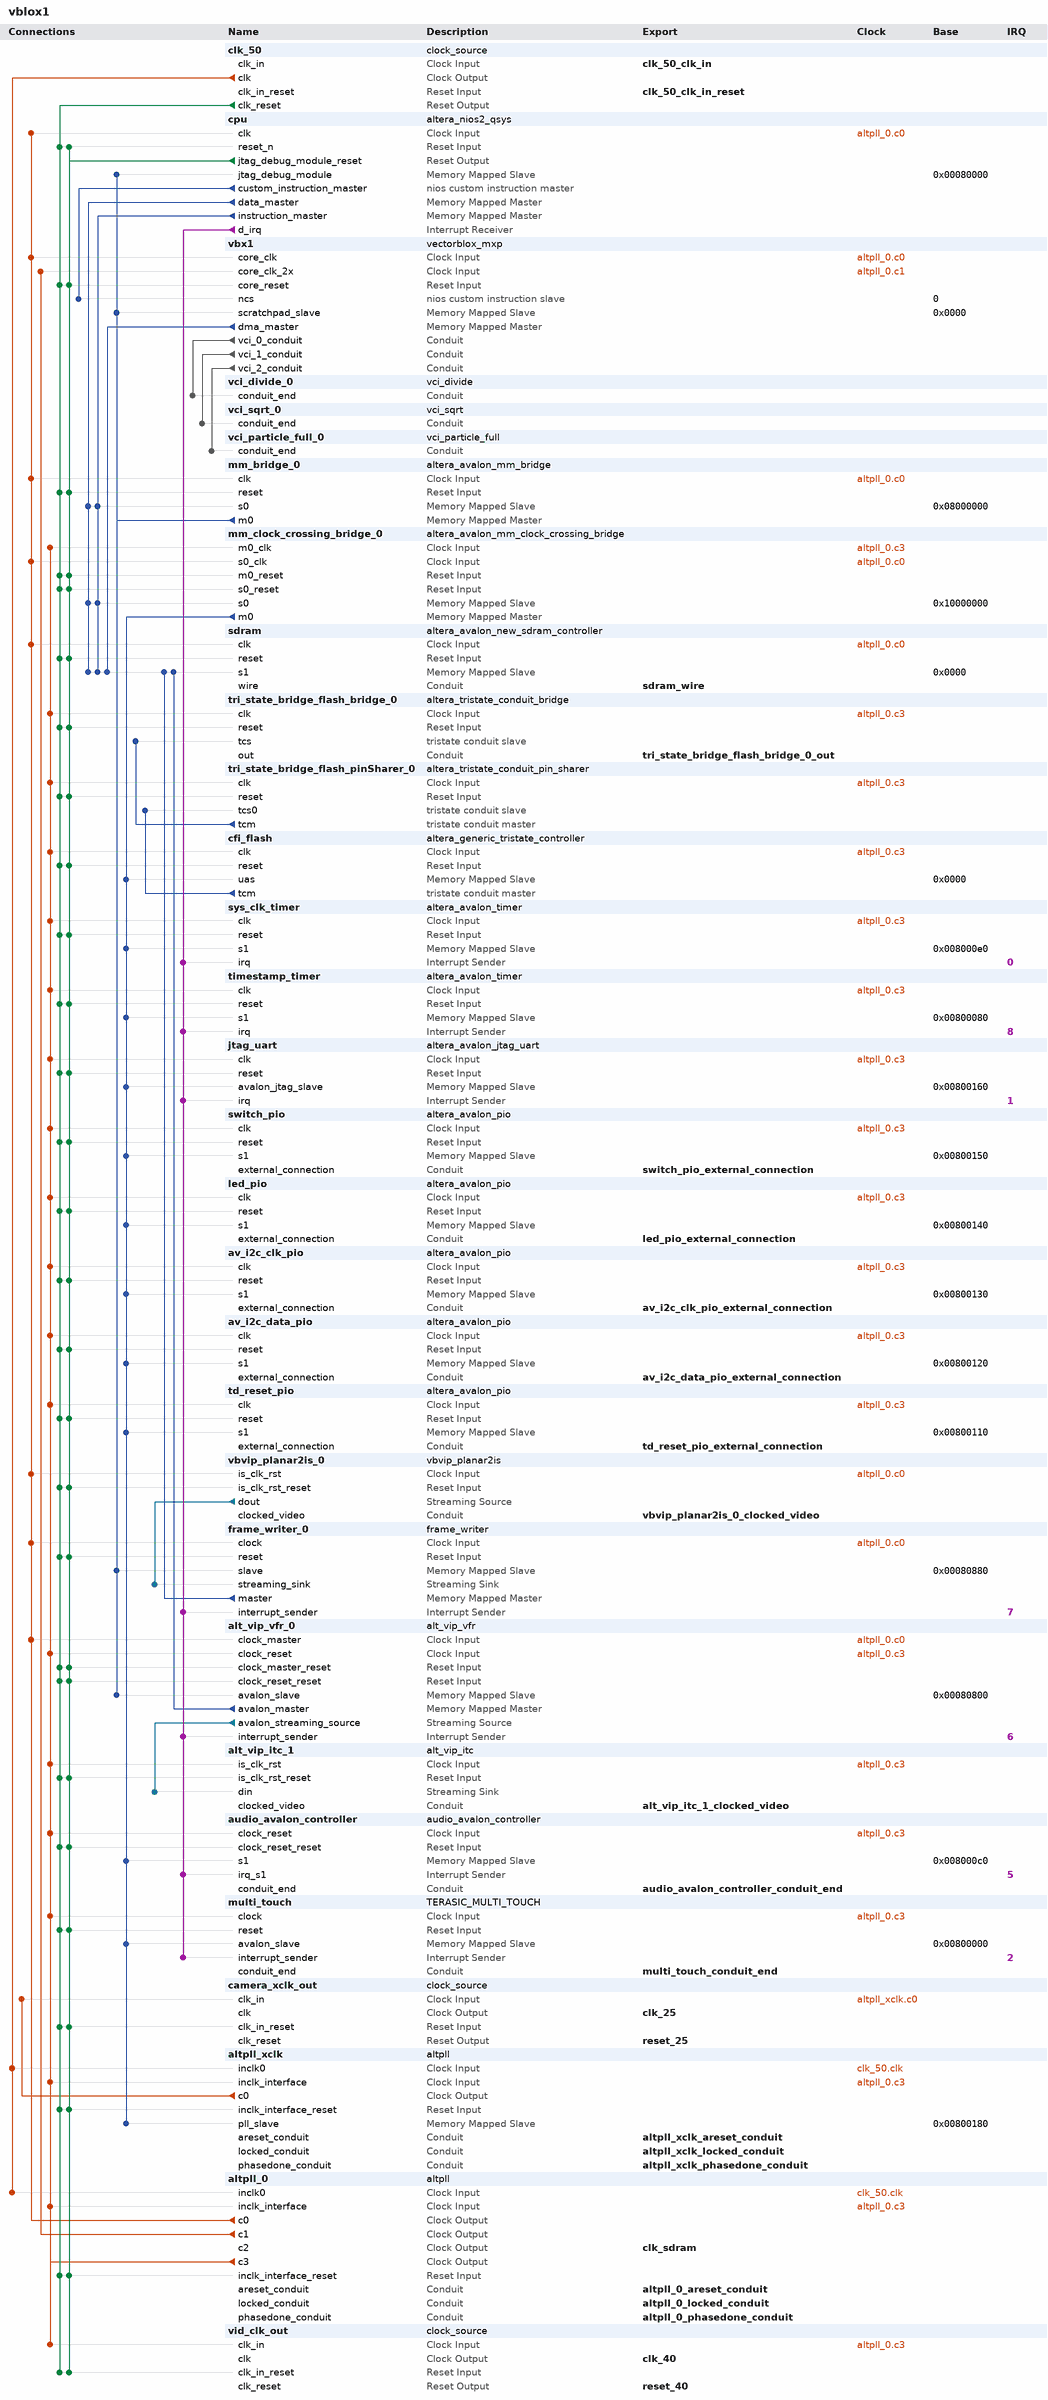
[diagram p0: system contents]
# Platform Designer (Qsys) system vblox1, Cyclone IV E EP4CE115F29C7
# Parameters at their usual value, and those the tool derives, are not listed.
package require -exact qsys 13.1
create_system vblox1
set_project_property DEVICE_FAMILY {Cyclone IV E}
set_project_property DEVICE EP4CE115F29C7

add_instance clk_50 clock_source 13.1
set_instance_parameter_value clk_50 clockFrequency 50000000

add_instance cpu altera_nios2_qsys 13.1
set_instance_parameter_value cpu manuallyAssignCpuID false
set_instance_parameter_value cpu resetSlave cfi_flash.uas
set_instance_parameter_value cpu exceptionSlave sdram.s1
set_instance_parameter_value cpu breakSlave cpu.jtag_debug_module
set_instance_parameter_value cpu impl Fast
set_instance_parameter_value cpu icache_size 8192
set_instance_parameter_value cpu icache_burstType Sequential
set_instance_parameter_value cpu dcache_bursts true
set_instance_parameter_value cpu dcache_size 4096

add_instance vbx1 vectorblox_mxp 1.0
set_instance_parameter_value vbx1 VECTOR_LANES 2
set_instance_parameter_value vbx1 MEMORY_WIDTH_LANES 1
set_instance_parameter_value vbx1 BEATS_PER_BURST 8
set_instance_parameter_value vbx1 SCRATCHPAD_KB 128
set_instance_parameter_value vbx1 MIN_MULTIPLIER_HW BYTE
set_instance_parameter_value vbx1 MASK_PARTITIONS 1
set_instance_parameter_value vbx1 MAX_MASKED_WAVES 256
set_instance_parameter_value vbx1 VECTOR_CUSTOM_INSTRUCTIONS 3
set_instance_parameter_value vbx1 VCI_0_LANES 2
set_instance_parameter_value vbx1 VCI_0_OPCODE_START 0
set_instance_parameter_value vbx1 VCI_0_FUNCTIONS 1
set_instance_parameter_value vbx1 VCI_0_FUNCTION_0_DEPTH 50
set_instance_parameter_value vbx1 VCI_0_FUNCTION_1_DEPTH 0
set_instance_parameter_value vbx1 VCI_0_FUNCTION_2_DEPTH 0
set_instance_parameter_value vbx1 VCI_0_FUNCTION_3_DEPTH 0
set_instance_parameter_value vbx1 VCI_0_FUNCTION_4_DEPTH 0
set_instance_parameter_value vbx1 VCI_0_FUNCTION_5_DEPTH 0
set_instance_parameter_value vbx1 VCI_0_FUNCTION_6_DEPTH 0
set_instance_parameter_value vbx1 VCI_0_FUNCTION_7_DEPTH 0
set_instance_parameter_value vbx1 VCI_0_FUNCTION_8_DEPTH 0
set_instance_parameter_value vbx1 VCI_0_FUNCTION_9_DEPTH 0
set_instance_parameter_value vbx1 VCI_0_FUNCTION_10_DEPTH 0
set_instance_parameter_value vbx1 VCI_0_FUNCTION_11_DEPTH 0
set_instance_parameter_value vbx1 VCI_0_FUNCTION_12_DEPTH 0
set_instance_parameter_value vbx1 VCI_0_FUNCTION_13_DEPTH 0
set_instance_parameter_value vbx1 VCI_0_FUNCTION_14_DEPTH 0
set_instance_parameter_value vbx1 VCI_0_FUNCTION_15_DEPTH 0
set_instance_parameter_value vbx1 VCI_0_MODIFIES_DEST_ADDR false
set_instance_parameter_value vbx1 VCI_1_LANES 2
set_instance_parameter_value vbx1 VCI_1_OPCODE_START 1
set_instance_parameter_value vbx1 VCI_1_FUNCTIONS 1
set_instance_parameter_value vbx1 VCI_1_FUNCTION_0_DEPTH 16
set_instance_parameter_value vbx1 VCI_1_FUNCTION_1_DEPTH 0
set_instance_parameter_value vbx1 VCI_1_FUNCTION_2_DEPTH 0
set_instance_parameter_value vbx1 VCI_1_FUNCTION_3_DEPTH 0
set_instance_parameter_value vbx1 VCI_1_FUNCTION_4_DEPTH 0
set_instance_parameter_value vbx1 VCI_1_FUNCTION_5_DEPTH 0
set_instance_parameter_value vbx1 VCI_1_FUNCTION_6_DEPTH 0
set_instance_parameter_value vbx1 VCI_1_FUNCTION_7_DEPTH 0
set_instance_parameter_value vbx1 VCI_1_FUNCTION_8_DEPTH 0
set_instance_parameter_value vbx1 VCI_1_FUNCTION_9_DEPTH 0
set_instance_parameter_value vbx1 VCI_1_FUNCTION_10_DEPTH 0
set_instance_parameter_value vbx1 VCI_1_FUNCTION_11_DEPTH 0
set_instance_parameter_value vbx1 VCI_1_FUNCTION_12_DEPTH 0
set_instance_parameter_value vbx1 VCI_1_FUNCTION_13_DEPTH 0
set_instance_parameter_value vbx1 VCI_1_FUNCTION_14_DEPTH 0
set_instance_parameter_value vbx1 VCI_1_MODIFIES_DEST_ADDR false
set_instance_parameter_value vbx1 VCI_2_LANES 2
set_instance_parameter_value vbx1 VCI_2_OPCODE_START 3
set_instance_parameter_value vbx1 VCI_2_FUNCTIONS 1
set_instance_parameter_value vbx1 VCI_2_FUNCTION_0_DEPTH 2
set_instance_parameter_value vbx1 VCI_2_FUNCTION_1_DEPTH 0
set_instance_parameter_value vbx1 VCI_2_FUNCTION_2_DEPTH 0
set_instance_parameter_value vbx1 VCI_2_FUNCTION_3_DEPTH 0
set_instance_parameter_value vbx1 VCI_2_FUNCTION_4_DEPTH 0
set_instance_parameter_value vbx1 VCI_2_FUNCTION_5_DEPTH 0
set_instance_parameter_value vbx1 VCI_2_FUNCTION_6_DEPTH 0
set_instance_parameter_value vbx1 VCI_2_FUNCTION_7_DEPTH 0
set_instance_parameter_value vbx1 VCI_2_FUNCTION_8_DEPTH 0
set_instance_parameter_value vbx1 VCI_2_FUNCTION_9_DEPTH 0
set_instance_parameter_value vbx1 VCI_2_FUNCTION_10_DEPTH 0
set_instance_parameter_value vbx1 VCI_2_FUNCTION_11_DEPTH 0
set_instance_parameter_value vbx1 VCI_2_FUNCTION_12_DEPTH 0
set_instance_parameter_value vbx1 VCI_2_FUNCTION_13_DEPTH 0
set_instance_parameter_value vbx1 VCI_2_MODIFIES_DEST_ADDR true
set_instance_parameter_value vbx1 VCI_3_LANES 1
set_instance_parameter_value vbx1 VCI_3_OPCODE_START 3
set_instance_parameter_value vbx1 VCI_3_FUNCTIONS 1
set_instance_parameter_value vbx1 VCI_3_FUNCTION_0_DEPTH 0
set_instance_parameter_value vbx1 VCI_3_FUNCTION_1_DEPTH 0
set_instance_parameter_value vbx1 VCI_3_FUNCTION_2_DEPTH 0
set_instance_parameter_value vbx1 VCI_3_FUNCTION_3_DEPTH 0
set_instance_parameter_value vbx1 VCI_3_FUNCTION_4_DEPTH 0
set_instance_parameter_value vbx1 VCI_3_FUNCTION_5_DEPTH 0
set_instance_parameter_value vbx1 VCI_3_FUNCTION_6_DEPTH 0
set_instance_parameter_value vbx1 VCI_3_FUNCTION_7_DEPTH 0
set_instance_parameter_value vbx1 VCI_3_FUNCTION_8_DEPTH 0
set_instance_parameter_value vbx1 VCI_3_FUNCTION_9_DEPTH 0
set_instance_parameter_value vbx1 VCI_3_FUNCTION_10_DEPTH 0
set_instance_parameter_value vbx1 VCI_3_FUNCTION_11_DEPTH 0
set_instance_parameter_value vbx1 VCI_3_FUNCTION_12_DEPTH 0
set_instance_parameter_value vbx1 VCI_3_MODIFIES_DEST_ADDR false
set_instance_parameter_value vbx1 VCI_4_LANES 1
set_instance_parameter_value vbx1 VCI_4_OPCODE_START 4
set_instance_parameter_value vbx1 VCI_4_FUNCTIONS 1
set_instance_parameter_value vbx1 VCI_4_FUNCTION_0_DEPTH 0
set_instance_parameter_value vbx1 VCI_4_FUNCTION_1_DEPTH 0
set_instance_parameter_value vbx1 VCI_4_FUNCTION_2_DEPTH 0
set_instance_parameter_value vbx1 VCI_4_FUNCTION_3_DEPTH 0
set_instance_parameter_value vbx1 VCI_4_FUNCTION_4_DEPTH 0
set_instance_parameter_value vbx1 VCI_4_FUNCTION_5_DEPTH 0
set_instance_parameter_value vbx1 VCI_4_FUNCTION_6_DEPTH 0
set_instance_parameter_value vbx1 VCI_4_FUNCTION_7_DEPTH 0
set_instance_parameter_value vbx1 VCI_4_FUNCTION_8_DEPTH 0
set_instance_parameter_value vbx1 VCI_4_FUNCTION_9_DEPTH 0
set_instance_parameter_value vbx1 VCI_4_FUNCTION_10_DEPTH 0
set_instance_parameter_value vbx1 VCI_4_FUNCTION_11_DEPTH 0
set_instance_parameter_value vbx1 VCI_4_MODIFIES_DEST_ADDR false
set_instance_parameter_value vbx1 VCI_5_LANES 1
set_instance_parameter_value vbx1 VCI_5_OPCODE_START 5
set_instance_parameter_value vbx1 VCI_5_FUNCTIONS 1
set_instance_parameter_value vbx1 VCI_5_FUNCTION_0_DEPTH 0
set_instance_parameter_value vbx1 VCI_5_FUNCTION_1_DEPTH 0
set_instance_parameter_value vbx1 VCI_5_FUNCTION_2_DEPTH 0
set_instance_parameter_value vbx1 VCI_5_FUNCTION_3_DEPTH 0
set_instance_parameter_value vbx1 VCI_5_FUNCTION_4_DEPTH 0
set_instance_parameter_value vbx1 VCI_5_FUNCTION_5_DEPTH 0
set_instance_parameter_value vbx1 VCI_5_FUNCTION_6_DEPTH 0
set_instance_parameter_value vbx1 VCI_5_FUNCTION_7_DEPTH 0
set_instance_parameter_value vbx1 VCI_5_FUNCTION_8_DEPTH 0
set_instance_parameter_value vbx1 VCI_5_FUNCTION_9_DEPTH 0
set_instance_parameter_value vbx1 VCI_5_FUNCTION_10_DEPTH 0
set_instance_parameter_value vbx1 VCI_5_MODIFIES_DEST_ADDR false
set_instance_parameter_value vbx1 VCI_6_LANES 1
set_instance_parameter_value vbx1 VCI_6_OPCODE_START 6
set_instance_parameter_value vbx1 VCI_6_FUNCTIONS 1
set_instance_parameter_value vbx1 VCI_6_FUNCTION_0_DEPTH 0
set_instance_parameter_value vbx1 VCI_6_FUNCTION_1_DEPTH 0
set_instance_parameter_value vbx1 VCI_6_FUNCTION_2_DEPTH 0
set_instance_parameter_value vbx1 VCI_6_FUNCTION_3_DEPTH 0
set_instance_parameter_value vbx1 VCI_6_FUNCTION_4_DEPTH 0
set_instance_parameter_value vbx1 VCI_6_FUNCTION_5_DEPTH 0
set_instance_parameter_value vbx1 VCI_6_FUNCTION_6_DEPTH 0
set_instance_parameter_value vbx1 VCI_6_FUNCTION_7_DEPTH 0
set_instance_parameter_value vbx1 VCI_6_FUNCTION_8_DEPTH 0
set_instance_parameter_value vbx1 VCI_6_FUNCTION_9_DEPTH 0
set_instance_parameter_value vbx1 VCI_6_MODIFIES_DEST_ADDR false
set_instance_parameter_value vbx1 VCI_7_LANES 1
set_instance_parameter_value vbx1 VCI_7_OPCODE_START 7
set_instance_parameter_value vbx1 VCI_7_FUNCTIONS 1
set_instance_parameter_value vbx1 VCI_7_FUNCTION_0_DEPTH 0
set_instance_parameter_value vbx1 VCI_7_FUNCTION_1_DEPTH 0
set_instance_parameter_value vbx1 VCI_7_FUNCTION_2_DEPTH 0
set_instance_parameter_value vbx1 VCI_7_FUNCTION_3_DEPTH 0
set_instance_parameter_value vbx1 VCI_7_FUNCTION_4_DEPTH 0
set_instance_parameter_value vbx1 VCI_7_FUNCTION_5_DEPTH 0
set_instance_parameter_value vbx1 VCI_7_FUNCTION_6_DEPTH 0
set_instance_parameter_value vbx1 VCI_7_FUNCTION_7_DEPTH 0
set_instance_parameter_value vbx1 VCI_7_FUNCTION_8_DEPTH 0
set_instance_parameter_value vbx1 VCI_7_MODIFIES_DEST_ADDR false
set_instance_parameter_value vbx1 VCI_8_LANES 1
set_instance_parameter_value vbx1 VCI_8_OPCODE_START 8
set_instance_parameter_value vbx1 VCI_8_FUNCTIONS 1
set_instance_parameter_value vbx1 VCI_8_FUNCTION_0_DEPTH 0
set_instance_parameter_value vbx1 VCI_8_FUNCTION_1_DEPTH 0
set_instance_parameter_value vbx1 VCI_8_FUNCTION_2_DEPTH 0
set_instance_parameter_value vbx1 VCI_8_FUNCTION_3_DEPTH 0
set_instance_parameter_value vbx1 VCI_8_FUNCTION_4_DEPTH 0
set_instance_parameter_value vbx1 VCI_8_FUNCTION_5_DEPTH 0
set_instance_parameter_value vbx1 VCI_8_FUNCTION_6_DEPTH 0
set_instance_parameter_value vbx1 VCI_8_FUNCTION_7_DEPTH 0
set_instance_parameter_value vbx1 VCI_8_MODIFIES_DEST_ADDR false
set_instance_parameter_value vbx1 VCI_9_LANES 1
set_instance_parameter_value vbx1 VCI_9_OPCODE_START 9
set_instance_parameter_value vbx1 VCI_9_FUNCTIONS 1
set_instance_parameter_value vbx1 VCI_9_FUNCTION_0_DEPTH 0
set_instance_parameter_value vbx1 VCI_9_FUNCTION_1_DEPTH 0
set_instance_parameter_value vbx1 VCI_9_FUNCTION_2_DEPTH 0
set_instance_parameter_value vbx1 VCI_9_FUNCTION_3_DEPTH 0
set_instance_parameter_value vbx1 VCI_9_FUNCTION_4_DEPTH 0
set_instance_parameter_value vbx1 VCI_9_FUNCTION_5_DEPTH 0
set_instance_parameter_value vbx1 VCI_9_FUNCTION_6_DEPTH 0
set_instance_parameter_value vbx1 VCI_9_MODIFIES_DEST_ADDR false
set_instance_parameter_value vbx1 VCI_10_LANES 1
set_instance_parameter_value vbx1 VCI_10_OPCODE_START 10
set_instance_parameter_value vbx1 VCI_10_FUNCTIONS 1
set_instance_parameter_value vbx1 VCI_10_FUNCTION_0_DEPTH 0
set_instance_parameter_value vbx1 VCI_10_FUNCTION_1_DEPTH 0
set_instance_parameter_value vbx1 VCI_10_FUNCTION_2_DEPTH 0
set_instance_parameter_value vbx1 VCI_10_FUNCTION_3_DEPTH 0
set_instance_parameter_value vbx1 VCI_10_FUNCTION_4_DEPTH 0
set_instance_parameter_value vbx1 VCI_10_FUNCTION_5_DEPTH 0
set_instance_parameter_value vbx1 VCI_10_MODIFIES_DEST_ADDR false
set_instance_parameter_value vbx1 VCI_11_LANES 1
set_instance_parameter_value vbx1 VCI_11_OPCODE_START 11
set_instance_parameter_value vbx1 VCI_11_FUNCTIONS 1
set_instance_parameter_value vbx1 VCI_11_FUNCTION_0_DEPTH 0
set_instance_parameter_value vbx1 VCI_11_FUNCTION_1_DEPTH 0
set_instance_parameter_value vbx1 VCI_11_FUNCTION_2_DEPTH 0
set_instance_parameter_value vbx1 VCI_11_FUNCTION_3_DEPTH 0
set_instance_parameter_value vbx1 VCI_11_FUNCTION_4_DEPTH 0
set_instance_parameter_value vbx1 VCI_11_MODIFIES_DEST_ADDR false
set_instance_parameter_value vbx1 VCI_12_LANES 1
set_instance_parameter_value vbx1 VCI_12_OPCODE_START 12
set_instance_parameter_value vbx1 VCI_12_FUNCTIONS 1
set_instance_parameter_value vbx1 VCI_12_FUNCTION_0_DEPTH 0
set_instance_parameter_value vbx1 VCI_12_FUNCTION_1_DEPTH 0
set_instance_parameter_value vbx1 VCI_12_FUNCTION_2_DEPTH 0
set_instance_parameter_value vbx1 VCI_12_FUNCTION_3_DEPTH 0
set_instance_parameter_value vbx1 VCI_12_MODIFIES_DEST_ADDR false
set_instance_parameter_value vbx1 VCI_13_LANES 1
set_instance_parameter_value vbx1 VCI_13_OPCODE_START 13
set_instance_parameter_value vbx1 VCI_13_FUNCTIONS 1
set_instance_parameter_value vbx1 VCI_13_FUNCTION_0_DEPTH 0
set_instance_parameter_value vbx1 VCI_13_FUNCTION_1_DEPTH 0
set_instance_parameter_value vbx1 VCI_13_FUNCTION_2_DEPTH 0
set_instance_parameter_value vbx1 VCI_13_MODIFIES_DEST_ADDR false
set_instance_parameter_value vbx1 VCI_14_LANES 1
set_instance_parameter_value vbx1 VCI_14_OPCODE_START 14
set_instance_parameter_value vbx1 VCI_14_FUNCTIONS 1
set_instance_parameter_value vbx1 VCI_14_FUNCTION_0_DEPTH 0
set_instance_parameter_value vbx1 VCI_14_FUNCTION_1_DEPTH 0
set_instance_parameter_value vbx1 VCI_14_MODIFIES_DEST_ADDR false
set_instance_parameter_value vbx1 VCI_15_LANES 1
set_instance_parameter_value vbx1 VCI_15_OPCODE_START 15
set_instance_parameter_value vbx1 VCI_15_FUNCTIONS 1
set_instance_parameter_value vbx1 VCI_15_FUNCTION_0_DEPTH 0
set_instance_parameter_value vbx1 VCI_15_MODIFIES_DEST_ADDR false
set_instance_parameter_value vbx1 MULFXP_WORD_FRACTION_BITS 16
set_instance_parameter_value vbx1 MULFXP_HALF_FRACTION_BITS 15
set_instance_parameter_value vbx1 MULFXP_BYTE_FRACTION_BITS 4
set_instance_parameter_value vbx1 CI_CLK_RATE 0
set_instance_parameter_value vbx1 CORE_CLK_RATE 100000000
set_instance_parameter_value vbx1 CORE_CLK_2X_RATE 200000000
set_instance_parameter_value vbx1 CI_CLK_DOMAIN 0
set_instance_parameter_value vbx1 CORE_CLK_DOMAIN 8
set_instance_parameter_value vbx1 CORE_CLK_2X_DOMAIN 9
set_instance_parameter_value vbx1 UNIQUE_ID {$${FILENAME}_vbx1}

add_instance vci_divide_0 vci_divide 1.0
set_instance_parameter_value vci_divide_0 VCI_LANES 2
set_instance_parameter_value vci_divide_0 FXP_BITS 16

add_instance vci_sqrt_0 vci_sqrt 1.0
set_instance_parameter_value vci_sqrt_0 VCI_LANES 2
set_instance_parameter_value vci_sqrt_0 FXP_BITS 16
set_instance_parameter_value vci_sqrt_0 PIPELINE_STAGES 16

add_instance vci_particle_full_0 vci_particle_full 1.0
set_instance_parameter_value vci_particle_full_0 VCI_LANES 2
set_instance_parameter_value vci_particle_full_0 FXP_BITS 16
set_instance_parameter_value vci_particle_full_0 OCT_DIST_APPROX 0
set_instance_parameter_value vci_particle_full_0 DSPBA_FLOATING 0

add_instance mm_bridge_0 altera_avalon_mm_bridge 13.1
set_instance_parameter_value mm_bridge_0 DATA_WIDTH 32
set_instance_parameter_value mm_bridge_0 ADDRESS_WIDTH 27
set_instance_parameter_value mm_bridge_0 ADDRESS_UNITS SYMBOLS
set_instance_parameter_value mm_bridge_0 MAX_PENDING_RESPONSES 4

add_instance mm_clock_crossing_bridge_0 altera_avalon_mm_clock_crossing_bridge 13.1
set_instance_parameter_value mm_clock_crossing_bridge_0 DATA_WIDTH 32
set_instance_parameter_value mm_clock_crossing_bridge_0 ADDRESS_WIDTH 27
set_instance_parameter_value mm_clock_crossing_bridge_0 MAX_BURST_SIZE 1
set_instance_parameter_value mm_clock_crossing_bridge_0 COMMAND_FIFO_DEPTH 4
set_instance_parameter_value mm_clock_crossing_bridge_0 RESPONSE_FIFO_DEPTH 4
set_instance_parameter_value mm_clock_crossing_bridge_0 MASTER_SYNC_DEPTH 2
set_instance_parameter_value mm_clock_crossing_bridge_0 SLAVE_SYNC_DEPTH 2

add_instance sdram altera_avalon_new_sdram_controller 13.1
set_instance_parameter_value sdram TAC 5.5
set_instance_parameter_value sdram TRCD 20.0
set_instance_parameter_value sdram TRP 20.0
set_instance_parameter_value sdram casLatency 3
set_instance_parameter_value sdram columnWidth 10
set_instance_parameter_value sdram dataWidth 32
set_instance_parameter_value sdram generateSimulationModel true
set_instance_parameter_value sdram model custom
set_instance_parameter_value sdram numberOfBanks 4
set_instance_parameter_value sdram numberOfChipSelects 1
set_instance_parameter_value sdram powerUpDelay 100.0
set_instance_parameter_value sdram refreshPeriod 15.625
set_instance_parameter_value sdram rowWidth 13

add_instance tri_state_bridge_flash_bridge_0 altera_tristate_conduit_bridge 13.1

add_instance tri_state_bridge_flash_pinSharer_0 altera_tristate_conduit_pin_sharer 13.1
set_instance_parameter_value tri_state_bridge_flash_pinSharer_0 NUM_INTERFACES 1
set_instance_parameter_value tri_state_bridge_flash_pinSharer_0 MODULE_ORIGIN_LIST cfi_flash.tcm,cfi_flash.tcm,cfi_flash.tcm,cfi_flash.tcm,cfi_flash.tcm
set_instance_parameter_value tri_state_bridge_flash_pinSharer_0 SHARED_SIGNAL_LIST address_to_the_cfi_flash,read_n_to_the_cfi_flash,write_n_to_the_cfi_flash,tri_state_bridge_flash_data,select_n_to_the_cfi_flash

add_instance cfi_flash altera_generic_tristate_controller 13.1
set_instance_parameter_value cfi_flash TCM_ADDRESS_W 23
set_instance_parameter_value cfi_flash TCM_DATA_W 8
set_instance_parameter_value cfi_flash TCM_BYTEENABLE_W 1
set_instance_parameter_value cfi_flash TCM_READ_WAIT 160
set_instance_parameter_value cfi_flash TCM_WRITE_WAIT 160
set_instance_parameter_value cfi_flash TCM_SETUP_WAIT 60
set_instance_parameter_value cfi_flash TCM_DATA_HOLD 60
set_instance_parameter_value cfi_flash TCM_MAX_PENDING_READ_TRANSACTIONS 3
set_instance_parameter_value cfi_flash TCM_TURNAROUND_TIME 2
set_instance_parameter_value cfi_flash TCM_TIMING_UNITS 0
set_instance_parameter_value cfi_flash TCM_READLATENCY 2
set_instance_parameter_value cfi_flash TCM_SYMBOLS_PER_WORD 1
set_instance_parameter_value cfi_flash USE_READ 1
set_instance_parameter_value cfi_flash USE_BEGINTRANSFER 0
set_instance_parameter_value cfi_flash USE_BYTEENABLE 0
set_instance_parameter_value cfi_flash USE_OUTPUTENABLE 0
set_instance_parameter_value cfi_flash ACTIVE_LOW_READ 1
set_instance_parameter_value cfi_flash ACTIVE_LOW_BYTEENABLE 0
set_instance_parameter_value cfi_flash ACTIVE_LOW_OUTPUTENABLE 0
set_instance_parameter_value cfi_flash ACTIVE_LOW_BEGINTRANSFER 0
set_instance_parameter_value cfi_flash CHIPSELECT_THROUGH_READLATENCY 0
set_instance_parameter_value cfi_flash MODULE_ASSIGNMENT_KEYS embeddedsw.configuration.hwClassnameDriverSupportList,embeddedsw.configuration.hwClassnameDriverSupportDefault,embeddedsw.CMacro.SETUP_VALUE,embeddedsw.CMacro.WAIT_VALUE,embeddedsw.CMacro.HOLD_VALUE,embeddedsw.CMacro.TIMING_UNITS,embeddedsw.CMacro.SIZE,embeddedsw.memoryInfo.MEM_INIT_DATA_WIDTH,embeddedsw.memoryInfo.HAS_BYTE_LANE,embeddedsw.memoryInfo.IS_FLASH,embeddedsw.memoryInfo.GENERATE_DAT_SYM,embeddedsw.memoryInfo.GENERATE_FLASH,embeddedsw.memoryInfo.DAT_SYM_INSTALL_DIR,embeddedsw.memoryInfo.FLASH_INSTALL_DIR
set_instance_parameter_value cfi_flash MODULE_ASSIGNMENT_VALUES {altera_avalon_lan91c111:altera_avalon_cfi_flash,altera_avalon_cfi_flash,60,160,60,"ns",8388608u,8,0,1,1,1,SIM_DIR,APP_DIR}
set_instance_parameter_value cfi_flash INTERFACE_ASSIGNMENT_KEYS embeddedsw.configuration.isFlash,embeddedsw.configuration.isMemoryDevice,embeddedsw.configuration.isNonVolatileStorage
set_instance_parameter_value cfi_flash INTERFACE_ASSIGNMENT_VALUES 1,1,1

add_instance sys_clk_timer altera_avalon_timer 13.1
set_instance_parameter_value sys_clk_timer period 10.0
set_instance_parameter_value sys_clk_timer periodUnits MSEC

add_instance timestamp_timer altera_avalon_timer 13.1
set_instance_parameter_value timestamp_timer counterSize 64
set_instance_parameter_value timestamp_timer period 1
set_instance_parameter_value timestamp_timer periodUnits MSEC

add_instance jtag_uart altera_avalon_jtag_uart 13.1
set_instance_parameter_value jtag_uart readBufferDepth 256
set_instance_parameter_value jtag_uart readIRQThreshold 4
set_instance_parameter_value jtag_uart simInteractiveOptions INTERACTIVE_ASCII_OUTPUT
set_instance_parameter_value jtag_uart writeBufferDepth 256
set_instance_parameter_value jtag_uart writeIRQThreshold 4

add_instance switch_pio altera_avalon_pio 13.1
set_instance_parameter_value switch_pio direction Input
set_instance_parameter_value switch_pio simDoTestBenchWiring true
set_instance_parameter_value switch_pio simDrivenValue 179951
set_instance_parameter_value switch_pio width 18

add_instance led_pio altera_avalon_pio 13.1
set_instance_parameter_value led_pio direction Output
set_instance_parameter_value led_pio width 8

add_instance av_i2c_clk_pio altera_avalon_pio 13.1
set_instance_parameter_value av_i2c_clk_pio direction Output
set_instance_parameter_value av_i2c_clk_pio width 1

add_instance av_i2c_data_pio altera_avalon_pio 13.1
set_instance_parameter_value av_i2c_data_pio direction Bidir
set_instance_parameter_value av_i2c_data_pio simDoTestBenchWiring true
set_instance_parameter_value av_i2c_data_pio width 1

add_instance td_reset_pio altera_avalon_pio 13.1
set_instance_parameter_value td_reset_pio direction Output
set_instance_parameter_value td_reset_pio width 1

add_instance vbvip_planar2is_0 vbvip_planar2is 1.0
set_instance_parameter_value vbvip_planar2is_0 DEFAULT_HSIZE 800
set_instance_parameter_value vbvip_planar2is_0 DEFAULT_VSIZE 480
set_instance_parameter_value vbvip_planar2is_0 DEFAULT_BPP 24
set_instance_parameter_value vbvip_planar2is_0 DEFAULT_FIFO_DEPTH_POW2 10

add_instance frame_writer_0 frame_writer 1.0

add_instance alt_vip_vfr_0 alt_vip_vfr 13.1
set_instance_parameter_value alt_vip_vfr_0 NUMBER_OF_CHANNELS_IN_PARALLEL 3
set_instance_parameter_value alt_vip_vfr_0 MAX_IMAGE_WIDTH 800
set_instance_parameter_value alt_vip_vfr_0 MAX_IMAGE_HEIGHT 480
set_instance_parameter_value alt_vip_vfr_0 MEM_PORT_WIDTH 32

add_instance alt_vip_itc_1 alt_vip_itc 13.1
set_instance_parameter_value alt_vip_itc_1 NUMBER_OF_COLOUR_PLANES 3
set_instance_parameter_value alt_vip_itc_1 H_ACTIVE_PIXELS 800
set_instance_parameter_value alt_vip_itc_1 V_ACTIVE_LINES 480
set_instance_parameter_value alt_vip_itc_1 FIFO_DEPTH 512
set_instance_parameter_value alt_vip_itc_1 THRESHOLD 0
set_instance_parameter_value alt_vip_itc_1 H_SYNC_LENGTH 30
set_instance_parameter_value alt_vip_itc_1 H_FRONT_PORCH 210
set_instance_parameter_value alt_vip_itc_1 H_BACK_PORCH 16
set_instance_parameter_value alt_vip_itc_1 V_SYNC_LENGTH 13
set_instance_parameter_value alt_vip_itc_1 V_FRONT_PORCH 22
set_instance_parameter_value alt_vip_itc_1 V_BACK_PORCH 10

add_instance audio_avalon_controller audio_avalon_controller 1.0

add_instance multi_touch TERASIC_MULTI_TOUCH 1.0

add_instance camera_xclk_out clock_source 13.1
set_instance_parameter_value camera_xclk_out clockFrequency 25000000

add_instance altpll_xclk altpll 13.1
set_instance_parameter_value altpll_xclk INCLK0_INPUT_FREQUENCY 20000
set_instance_parameter_value altpll_xclk CLK0_MULTIPLY_BY 1
set_instance_parameter_value altpll_xclk CLK1_MULTIPLY_BY 4
set_instance_parameter_value altpll_xclk CLK0_DIVIDE_BY 2
set_instance_parameter_value altpll_xclk CLK1_DIVIDE_BY 5
set_instance_parameter_value altpll_xclk CLK1_PHASE_SHIFT 0
set_instance_parameter_value altpll_xclk CLK1_DUTY_CYCLE 50
set_instance_parameter_value altpll_xclk PORT_clk1 PORT_UNUSED
set_instance_parameter_value altpll_xclk PORT_clk2 PORT_UNUSED
set_instance_parameter_value altpll_xclk PORT_clk3 PORT_UNUSED
set_instance_parameter_value altpll_xclk PORT_ARESET PORT_USED
set_instance_parameter_value altpll_xclk PORT_LOCKED PORT_USED
set_instance_parameter_value altpll_xclk AVALON_USE_SEPARATE_SYSCLK YES

add_instance altpll_0 altpll 13.1
set_instance_parameter_value altpll_0 INCLK0_INPUT_FREQUENCY 20000
set_instance_parameter_value altpll_0 CLK0_MULTIPLY_BY 2
set_instance_parameter_value altpll_0 CLK1_MULTIPLY_BY 4
set_instance_parameter_value altpll_0 CLK2_MULTIPLY_BY 2
set_instance_parameter_value altpll_0 CLK3_MULTIPLY_BY 4
set_instance_parameter_value altpll_0 CLK0_DIVIDE_BY 1
set_instance_parameter_value altpll_0 CLK1_DIVIDE_BY 1
set_instance_parameter_value altpll_0 CLK2_DIVIDE_BY 1
set_instance_parameter_value altpll_0 CLK3_DIVIDE_BY 5
set_instance_parameter_value altpll_0 CLK1_PHASE_SHIFT 0
set_instance_parameter_value altpll_0 CLK2_PHASE_SHIFT -42
set_instance_parameter_value altpll_0 CLK3_PHASE_SHIFT 0
set_instance_parameter_value altpll_0 CLK1_DUTY_CYCLE 50
set_instance_parameter_value altpll_0 CLK2_DUTY_CYCLE 50
set_instance_parameter_value altpll_0 CLK3_DUTY_CYCLE 50
set_instance_parameter_value altpll_0 PORT_clk1 PORT_USED
set_instance_parameter_value altpll_0 PORT_clk2 PORT_USED
set_instance_parameter_value altpll_0 PORT_clk3 PORT_USED
set_instance_parameter_value altpll_0 PORT_ARESET PORT_USED
set_instance_parameter_value altpll_0 PORT_LOCKED PORT_USED
set_instance_parameter_value altpll_0 AVALON_USE_SEPARATE_SYSCLK YES

add_instance vid_clk_out clock_source 13.1
set_instance_parameter_value vid_clk_out clockFrequency 40000000

# connections
add_connection altpll_0.c0 alt_vip_vfr_0.clock_master clock
add_connection altpll_0.c0 cpu.clk clock
add_connection altpll_0.c0 frame_writer_0.clock clock
add_connection altpll_0.c0 mm_bridge_0.clk clock
add_connection altpll_0.c0 mm_clock_crossing_bridge_0.s0_clk clock
add_connection altpll_0.c0 sdram.clk clock
add_connection altpll_0.c0 vbvip_planar2is_0.is_clk_rst clock
add_connection altpll_0.c0 vbx1.core_clk clock
add_connection altpll_0.c1 vbx1.core_clk_2x clock
add_connection altpll_0.c3 alt_vip_itc_1.is_clk_rst clock
add_connection altpll_0.c3 alt_vip_vfr_0.clock_reset clock
add_connection altpll_0.c3 altpll_0.inclk_interface clock
add_connection altpll_0.c3 altpll_xclk.inclk_interface clock
add_connection altpll_0.c3 audio_avalon_controller.clock_reset clock
add_connection altpll_0.c3 av_i2c_clk_pio.clk clock
add_connection altpll_0.c3 av_i2c_data_pio.clk clock
add_connection altpll_0.c3 cfi_flash.clk clock
add_connection altpll_0.c3 jtag_uart.clk clock
add_connection altpll_0.c3 led_pio.clk clock
add_connection altpll_0.c3 mm_clock_crossing_bridge_0.m0_clk clock
add_connection altpll_0.c3 multi_touch.clock clock
add_connection altpll_0.c3 switch_pio.clk clock
add_connection altpll_0.c3 sys_clk_timer.clk clock
add_connection altpll_0.c3 td_reset_pio.clk clock
add_connection altpll_0.c3 timestamp_timer.clk clock
add_connection altpll_0.c3 tri_state_bridge_flash_bridge_0.clk clock
add_connection altpll_0.c3 tri_state_bridge_flash_pinSharer_0.clk clock
add_connection altpll_0.c3 vid_clk_out.clk_in clock
add_connection altpll_xclk.c0 camera_xclk_out.clk_in clock
add_connection clk_50.clk altpll_0.inclk0 clock
add_connection clk_50.clk altpll_xclk.inclk0 clock
add_connection clk_50.clk_reset alt_vip_itc_1.is_clk_rst_reset reset
add_connection clk_50.clk_reset alt_vip_vfr_0.clock_master_reset reset
add_connection clk_50.clk_reset alt_vip_vfr_0.clock_reset_reset reset
add_connection clk_50.clk_reset altpll_0.inclk_interface_reset reset
add_connection clk_50.clk_reset altpll_xclk.inclk_interface_reset reset
add_connection clk_50.clk_reset audio_avalon_controller.clock_reset_reset reset
add_connection clk_50.clk_reset av_i2c_clk_pio.reset reset
add_connection clk_50.clk_reset av_i2c_data_pio.reset reset
add_connection clk_50.clk_reset camera_xclk_out.clk_in_reset reset
add_connection clk_50.clk_reset cfi_flash.reset reset
add_connection clk_50.clk_reset cpu.reset_n reset
add_connection clk_50.clk_reset frame_writer_0.reset reset
add_connection clk_50.clk_reset jtag_uart.reset reset
add_connection clk_50.clk_reset led_pio.reset reset
add_connection clk_50.clk_reset mm_bridge_0.reset reset
add_connection clk_50.clk_reset mm_clock_crossing_bridge_0.m0_reset reset
add_connection clk_50.clk_reset mm_clock_crossing_bridge_0.s0_reset reset
add_connection clk_50.clk_reset multi_touch.reset reset
add_connection clk_50.clk_reset sdram.reset reset
add_connection clk_50.clk_reset switch_pio.reset reset
add_connection clk_50.clk_reset sys_clk_timer.reset reset
add_connection clk_50.clk_reset td_reset_pio.reset reset
add_connection clk_50.clk_reset timestamp_timer.reset reset
add_connection clk_50.clk_reset tri_state_bridge_flash_bridge_0.reset reset
add_connection clk_50.clk_reset tri_state_bridge_flash_pinSharer_0.reset reset
add_connection clk_50.clk_reset vbvip_planar2is_0.is_clk_rst_reset reset
add_connection clk_50.clk_reset vbx1.core_reset reset
add_connection clk_50.clk_reset vid_clk_out.clk_in_reset reset
add_connection cpu.jtag_debug_module_reset alt_vip_itc_1.is_clk_rst_reset reset
add_connection cpu.jtag_debug_module_reset alt_vip_vfr_0.clock_master_reset reset
add_connection cpu.jtag_debug_module_reset alt_vip_vfr_0.clock_reset_reset reset
add_connection cpu.jtag_debug_module_reset altpll_0.inclk_interface_reset reset
add_connection cpu.jtag_debug_module_reset altpll_xclk.inclk_interface_reset reset
add_connection cpu.jtag_debug_module_reset audio_avalon_controller.clock_reset_reset reset
add_connection cpu.jtag_debug_module_reset av_i2c_clk_pio.reset reset
add_connection cpu.jtag_debug_module_reset av_i2c_data_pio.reset reset
add_connection cpu.jtag_debug_module_reset camera_xclk_out.clk_in_reset reset
add_connection cpu.jtag_debug_module_reset cfi_flash.reset reset
add_connection cpu.jtag_debug_module_reset cpu.reset_n reset
add_connection cpu.jtag_debug_module_reset frame_writer_0.reset reset
add_connection cpu.jtag_debug_module_reset jtag_uart.reset reset
add_connection cpu.jtag_debug_module_reset led_pio.reset reset
add_connection cpu.jtag_debug_module_reset mm_bridge_0.reset reset
add_connection cpu.jtag_debug_module_reset mm_clock_crossing_bridge_0.m0_reset reset
add_connection cpu.jtag_debug_module_reset mm_clock_crossing_bridge_0.s0_reset reset
add_connection cpu.jtag_debug_module_reset multi_touch.reset reset
add_connection cpu.jtag_debug_module_reset sdram.reset reset
add_connection cpu.jtag_debug_module_reset switch_pio.reset reset
add_connection cpu.jtag_debug_module_reset sys_clk_timer.reset reset
add_connection cpu.jtag_debug_module_reset td_reset_pio.reset reset
add_connection cpu.jtag_debug_module_reset timestamp_timer.reset reset
add_connection cpu.jtag_debug_module_reset tri_state_bridge_flash_bridge_0.reset reset
add_connection cpu.jtag_debug_module_reset tri_state_bridge_flash_pinSharer_0.reset reset
add_connection cpu.jtag_debug_module_reset vbvip_planar2is_0.is_clk_rst_reset reset
add_connection cpu.jtag_debug_module_reset vbx1.core_reset reset
add_connection cpu.jtag_debug_module_reset vid_clk_out.clk_in_reset reset
add_connection alt_vip_vfr_0.avalon_master sdram.s1 avalon
set_connection_parameter_value alt_vip_vfr_0.avalon_master/sdram.s1 baseAddress 0x0000
add_connection cpu.data_master mm_bridge_0.s0 avalon
set_connection_parameter_value cpu.data_master/mm_bridge_0.s0 baseAddress 0x08000000
add_connection cpu.data_master mm_clock_crossing_bridge_0.s0 avalon
set_connection_parameter_value cpu.data_master/mm_clock_crossing_bridge_0.s0 baseAddress 0x10000000
add_connection cpu.data_master sdram.s1 avalon
set_connection_parameter_value cpu.data_master/sdram.s1 baseAddress 0x0000
add_connection cpu.instruction_master mm_bridge_0.s0 avalon
set_connection_parameter_value cpu.instruction_master/mm_bridge_0.s0 baseAddress 0x08000000
add_connection cpu.instruction_master mm_clock_crossing_bridge_0.s0 avalon
set_connection_parameter_value cpu.instruction_master/mm_clock_crossing_bridge_0.s0 baseAddress 0x10000000
add_connection cpu.instruction_master sdram.s1 avalon
set_connection_parameter_value cpu.instruction_master/sdram.s1 baseAddress 0x0000
add_connection frame_writer_0.master sdram.s1 avalon
set_connection_parameter_value frame_writer_0.master/sdram.s1 baseAddress 0x0000
add_connection mm_bridge_0.m0 alt_vip_vfr_0.avalon_slave avalon
set_connection_parameter_value mm_bridge_0.m0/alt_vip_vfr_0.avalon_slave baseAddress 0x00080800
add_connection mm_bridge_0.m0 cpu.jtag_debug_module avalon
set_connection_parameter_value mm_bridge_0.m0/cpu.jtag_debug_module baseAddress 0x00080000
add_connection mm_bridge_0.m0 frame_writer_0.slave avalon
set_connection_parameter_value mm_bridge_0.m0/frame_writer_0.slave baseAddress 0x00080880
add_connection mm_bridge_0.m0 vbx1.scratchpad_slave avalon
set_connection_parameter_value mm_bridge_0.m0/vbx1.scratchpad_slave baseAddress 0x0000
add_connection mm_clock_crossing_bridge_0.m0 altpll_xclk.pll_slave avalon
set_connection_parameter_value mm_clock_crossing_bridge_0.m0/altpll_xclk.pll_slave baseAddress 0x00800180
add_connection mm_clock_crossing_bridge_0.m0 audio_avalon_controller.s1 avalon
set_connection_parameter_value mm_clock_crossing_bridge_0.m0/audio_avalon_controller.s1 baseAddress 0x008000c0
add_connection mm_clock_crossing_bridge_0.m0 av_i2c_clk_pio.s1 avalon
set_connection_parameter_value mm_clock_crossing_bridge_0.m0/av_i2c_clk_pio.s1 baseAddress 0x00800130
add_connection mm_clock_crossing_bridge_0.m0 av_i2c_data_pio.s1 avalon
set_connection_parameter_value mm_clock_crossing_bridge_0.m0/av_i2c_data_pio.s1 baseAddress 0x00800120
add_connection mm_clock_crossing_bridge_0.m0 cfi_flash.uas avalon
set_connection_parameter_value mm_clock_crossing_bridge_0.m0/cfi_flash.uas baseAddress 0x0000
add_connection mm_clock_crossing_bridge_0.m0 jtag_uart.avalon_jtag_slave avalon
set_connection_parameter_value mm_clock_crossing_bridge_0.m0/jtag_uart.avalon_jtag_slave baseAddress 0x00800160
add_connection mm_clock_crossing_bridge_0.m0 led_pio.s1 avalon
set_connection_parameter_value mm_clock_crossing_bridge_0.m0/led_pio.s1 baseAddress 0x00800140
add_connection mm_clock_crossing_bridge_0.m0 multi_touch.avalon_slave avalon
set_connection_parameter_value mm_clock_crossing_bridge_0.m0/multi_touch.avalon_slave baseAddress 0x00800000
add_connection mm_clock_crossing_bridge_0.m0 switch_pio.s1 avalon
set_connection_parameter_value mm_clock_crossing_bridge_0.m0/switch_pio.s1 baseAddress 0x00800150
add_connection mm_clock_crossing_bridge_0.m0 sys_clk_timer.s1 avalon
set_connection_parameter_value mm_clock_crossing_bridge_0.m0/sys_clk_timer.s1 baseAddress 0x008000e0
add_connection mm_clock_crossing_bridge_0.m0 td_reset_pio.s1 avalon
set_connection_parameter_value mm_clock_crossing_bridge_0.m0/td_reset_pio.s1 baseAddress 0x00800110
add_connection mm_clock_crossing_bridge_0.m0 timestamp_timer.s1 avalon
set_connection_parameter_value mm_clock_crossing_bridge_0.m0/timestamp_timer.s1 baseAddress 0x00800080
add_connection vbx1.dma_master sdram.s1 avalon
set_connection_parameter_value vbx1.dma_master/sdram.s1 baseAddress 0x0000
add_connection alt_vip_vfr_0.avalon_streaming_source alt_vip_itc_1.din avalon_streaming
add_connection vbvip_planar2is_0.dout frame_writer_0.streaming_sink avalon_streaming
add_connection vbx1.vci_0_conduit vci_divide_0.conduit_end conduit
add_connection vbx1.vci_1_conduit vci_sqrt_0.conduit_end conduit
add_connection vbx1.vci_2_conduit vci_particle_full_0.conduit_end conduit
add_connection cpu.d_irq alt_vip_vfr_0.interrupt_sender interrupt
set_connection_parameter_value cpu.d_irq/alt_vip_vfr_0.interrupt_sender irqNumber 6
add_connection cpu.d_irq audio_avalon_controller.irq_s1 interrupt
set_connection_parameter_value cpu.d_irq/audio_avalon_controller.irq_s1 irqNumber 5
add_connection cpu.d_irq frame_writer_0.interrupt_sender interrupt
set_connection_parameter_value cpu.d_irq/frame_writer_0.interrupt_sender irqNumber 7
add_connection cpu.d_irq jtag_uart.irq interrupt
set_connection_parameter_value cpu.d_irq/jtag_uart.irq irqNumber 1
add_connection cpu.d_irq multi_touch.interrupt_sender interrupt
set_connection_parameter_value cpu.d_irq/multi_touch.interrupt_sender irqNumber 2
add_connection cpu.d_irq sys_clk_timer.irq interrupt
set_connection_parameter_value cpu.d_irq/sys_clk_timer.irq irqNumber 0
add_connection cpu.d_irq timestamp_timer.irq interrupt
set_connection_parameter_value cpu.d_irq/timestamp_timer.irq irqNumber 8
add_connection cpu.custom_instruction_master vbx1.ncs nios_custom_instruction
set_connection_parameter_value cpu.custom_instruction_master/vbx1.ncs CIName vectorblox_ncs_shim_0
set_connection_parameter_value cpu.custom_instruction_master/vbx1.ncs baseAddress 0
add_connection cfi_flash.tcm tri_state_bridge_flash_pinSharer_0.tcs0 tristate_conduit
add_connection tri_state_bridge_flash_pinSharer_0.tcm tri_state_bridge_flash_bridge_0.tcs tristate_conduit

# exported interfaces
add_interface clk_50_clk_in clock sink
set_interface_property clk_50_clk_in EXPORT_OF clk_50.clk_in
add_interface av_i2c_clk_pio_external_connection conduit end
set_interface_property av_i2c_clk_pio_external_connection EXPORT_OF av_i2c_clk_pio.external_connection
add_interface clk_50_clk_in_reset reset sink
set_interface_property clk_50_clk_in_reset EXPORT_OF clk_50.clk_in_reset
add_interface av_i2c_data_pio_external_connection conduit end
set_interface_property av_i2c_data_pio_external_connection EXPORT_OF av_i2c_data_pio.external_connection
add_interface led_pio_external_connection conduit end
set_interface_property led_pio_external_connection EXPORT_OF led_pio.external_connection
add_interface switch_pio_external_connection conduit end
set_interface_property switch_pio_external_connection EXPORT_OF switch_pio.external_connection
add_interface sdram_wire conduit end
set_interface_property sdram_wire EXPORT_OF sdram.wire
add_interface td_reset_pio_external_connection conduit end
set_interface_property td_reset_pio_external_connection EXPORT_OF td_reset_pio.external_connection
add_interface alt_vip_itc_1_clocked_video conduit end
set_interface_property alt_vip_itc_1_clocked_video EXPORT_OF alt_vip_itc_1.clocked_video
add_interface tri_state_bridge_flash_bridge_0_out conduit end
set_interface_property tri_state_bridge_flash_bridge_0_out EXPORT_OF tri_state_bridge_flash_bridge_0.out
add_interface audio_avalon_controller_conduit_end conduit end
set_interface_property audio_avalon_controller_conduit_end EXPORT_OF audio_avalon_controller.conduit_end
add_interface vbvip_planar2is_0_clocked_video conduit end
set_interface_property vbvip_planar2is_0_clocked_video EXPORT_OF vbvip_planar2is_0.clocked_video
add_interface multi_touch_conduit_end conduit end
set_interface_property multi_touch_conduit_end EXPORT_OF multi_touch.conduit_end
add_interface reset_25 reset source
set_interface_property reset_25 EXPORT_OF camera_xclk_out.clk_reset
add_interface altpll_xclk_areset_conduit conduit end
set_interface_property altpll_xclk_areset_conduit EXPORT_OF altpll_xclk.areset_conduit
add_interface altpll_xclk_locked_conduit conduit end
set_interface_property altpll_xclk_locked_conduit EXPORT_OF altpll_xclk.locked_conduit
add_interface altpll_xclk_phasedone_conduit conduit end
set_interface_property altpll_xclk_phasedone_conduit EXPORT_OF altpll_xclk.phasedone_conduit
add_interface clk_sdram clock source
set_interface_property clk_sdram EXPORT_OF altpll_0.c2
add_interface altpll_0_areset_conduit conduit end
set_interface_property altpll_0_areset_conduit EXPORT_OF altpll_0.areset_conduit
add_interface altpll_0_locked_conduit conduit end
set_interface_property altpll_0_locked_conduit EXPORT_OF altpll_0.locked_conduit
add_interface altpll_0_phasedone_conduit conduit end
set_interface_property altpll_0_phasedone_conduit EXPORT_OF altpll_0.phasedone_conduit
add_interface clk_40 clock source
set_interface_property clk_40 EXPORT_OF vid_clk_out.clk
add_interface reset_40 reset source
set_interface_property reset_40 EXPORT_OF vid_clk_out.clk_reset
add_interface clk_25 clock source
set_interface_property clk_25 EXPORT_OF camera_xclk_out.clk

set_interconnect_requirement {$system} qsys_mm.clockCrossingAdapter AUTO
set_interconnect_requirement {$system} qsys_mm.maxAdditionalLatency 4

save_system vblox1.qsys
